# EAGLE schematic controller_board (EAGLE 9.6.2)
Assembly variants: Minimal, FullAwesome
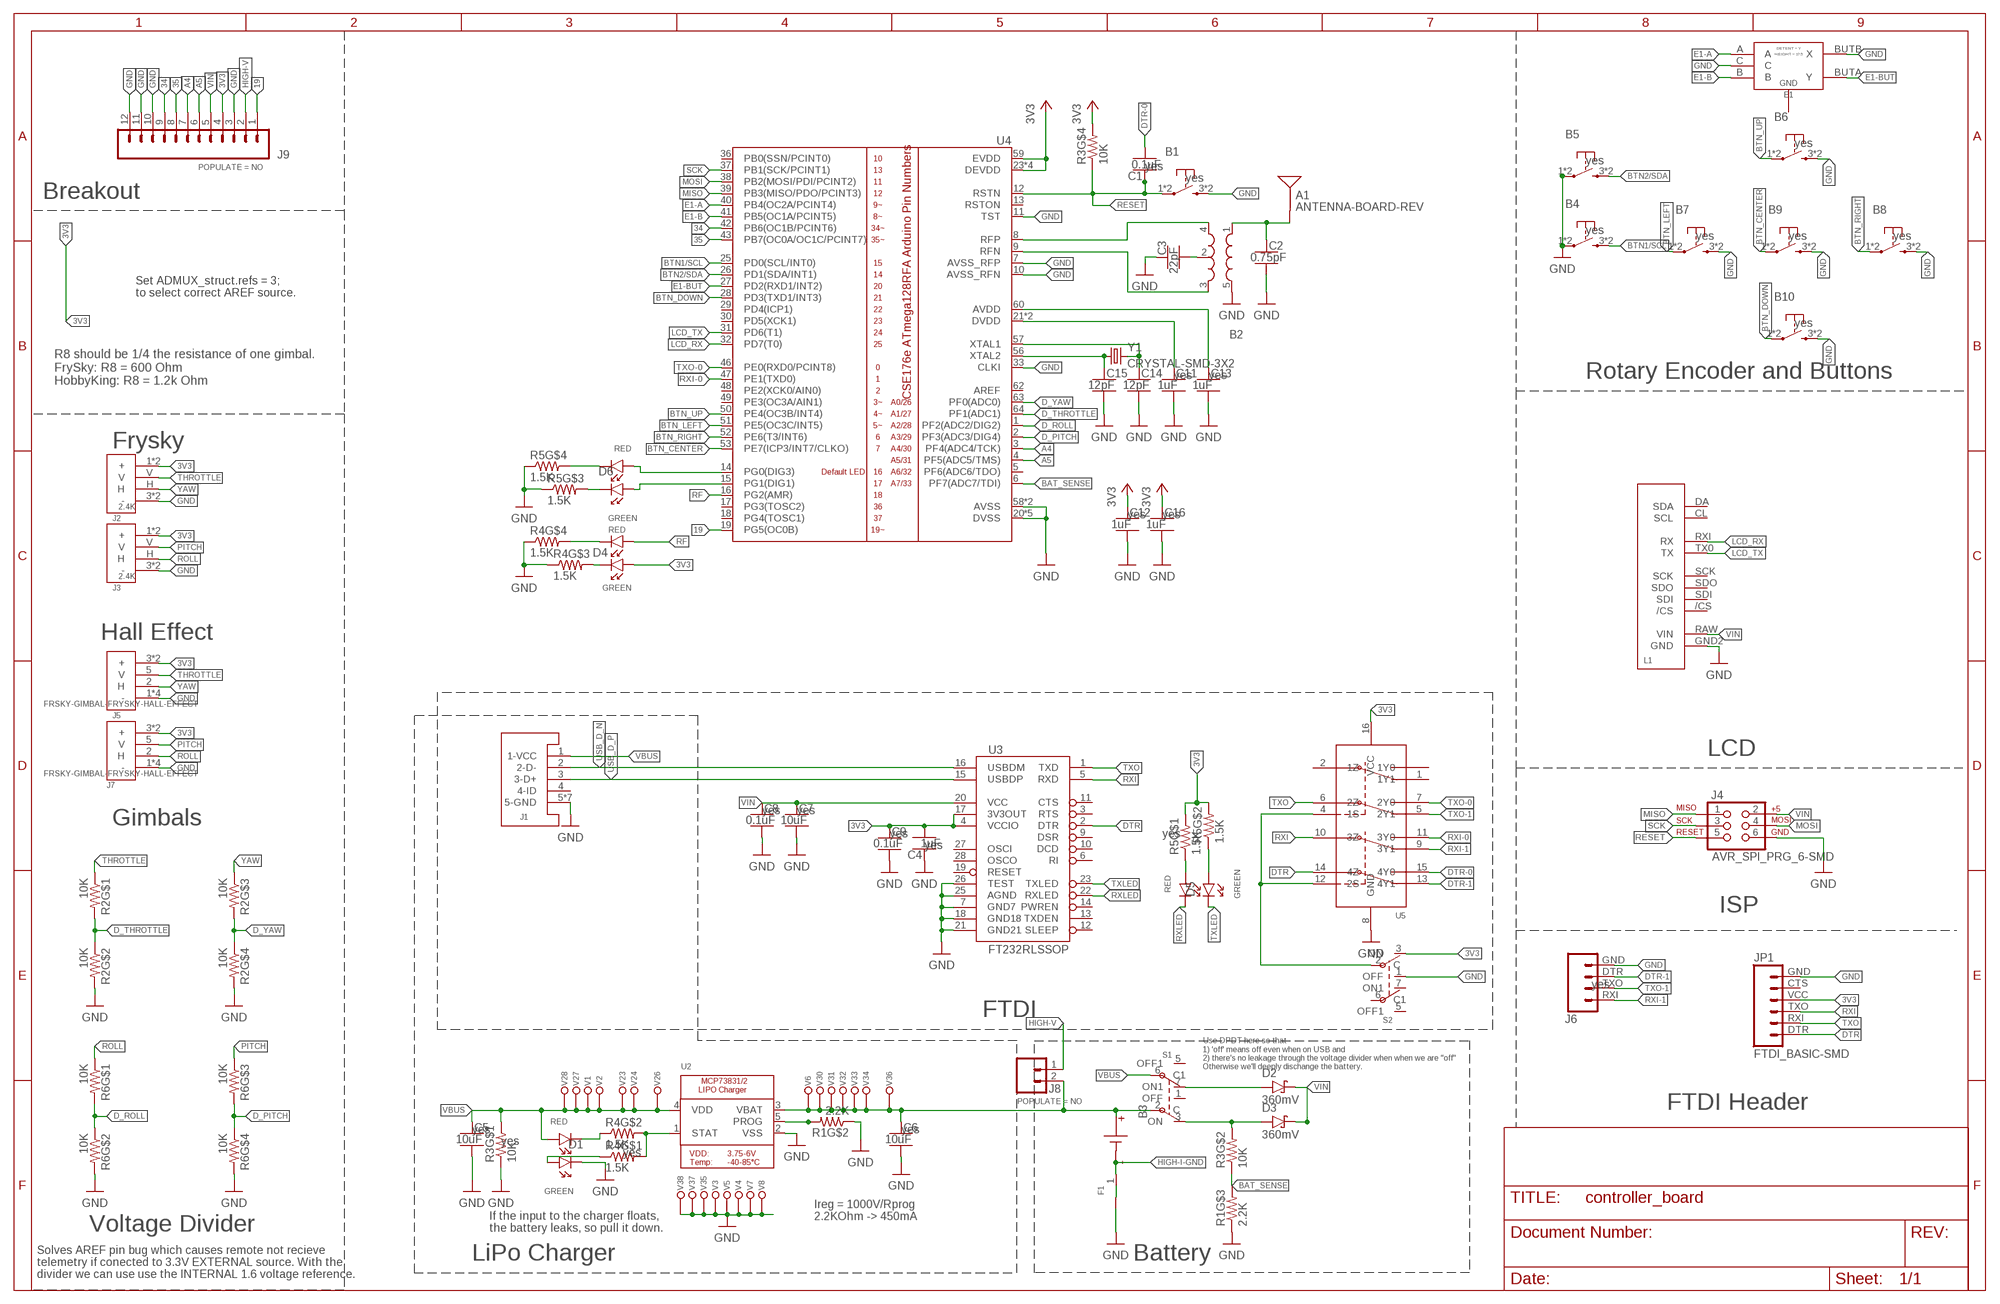
[diagram p0: schematic, sheet 1]
FRAME1 (FRAME_B_L): CREATOR: Unknown; DIST: Unknown; DISTPN: Unknown

## Parts
A1  ANTENNA-BOARD-REV  [ANT_PCB_2.4GHZ_NRF8001_1.6MM_1OZ_REV]
B1  PUSHBUTTON_-4.5X4.5  [4.5MM_TACTILE_SWITCH_TL3305AF160QG]
B2  BALUN0805  [BALUN]
B3  BATTERY-SCREW-TERMINAL  [SCREW-TERMINAL-1X2-2.54MM]
B4  PUSHBUTTON_-4.5X4.5  [4.5MM_TACTILE_SWITCH_TL3305AF160QG]  (not fitted in variant Minimal)
B5  PUSHBUTTON_-4.5X4.5  [4.5MM_TACTILE_SWITCH_TL3305AF160QG]  (not fitted in variant Minimal)
B6  PUSHBUTTON_-4.5X4.5  [4.5MM_TACTILE_SWITCH_TL3305AF160QG]
B7  PUSHBUTTON_-4.5X4.5  [4.5MM_TACTILE_SWITCH_TL3305AF160QG]
B8  PUSHBUTTON_-4.5X4.5  [4.5MM_TACTILE_SWITCH_TL3305AF160QG]
B9  PUSHBUTTON_-4.5X4.5  [4.5MM_TACTILE_SWITCH_TL3305AF160QG]
B10  PUSHBUTTON_-4.5X4.5  [4.5MM_TACTILE_SWITCH_TL3305AF160QG]
C1  0.1uF  CAPACITOR-NP_SMD-0603_CERAMIC-0.1UF  [CAPC1608X100]
C2  0.75pF  CAPACITOR-NP_SMD-0603_CERAMIC-0.75PF  [CAPC1608X100]
C3  22pF  CAPACITOR-NP_SMD-0603_CERAMIC-22PF  [CAPC1608X100]
C4  1uF  CAPACITOR-NP_SMD-0603_CERAMIC-1UF  [CAPC1608X100]
C5  10uF  CAPACITOR-NP_SMD-0603_CERAMIC-10UF  [CAPC1608X100]
C6  10uF  CAPACITOR-NP_SMD-0603_CERAMIC-10UF  [CAPC1608X100]
C7  10uF  CAPACITOR-NP_SMD-0603_CERAMIC-10UF  [CAPC1608X100]  (not fitted in variant Minimal)
C8  0.1uF  CAPACITOR-NP_SMD-0603_CERAMIC-0.1UF  [CAPC1608X100]  (not fitted in variant Minimal)
C9  0.1uF  CAPACITOR-NP_SMD-0603_CERAMIC-0.1UF  [CAPC1608X100]  (not fitted in variant Minimal)
C11  1uF  CAPACITOR-NP_SMD-0603_CERAMIC-1UF  [CAPC1608X100]
C12  1uF  CAPACITOR-NP_SMD-0603_CERAMIC-1UF  [CAPC1608X100]
C13  1uF  CAPACITOR-NP_SMD-0603_CERAMIC-1UF  [CAPC1608X100]
C14  12pF  CAPACITOR-NP_SMD-0603_CERAMIC-12PF  [CAPC1608X100]
C15  12pF  CAPACITOR-NP_SMD-0603_CERAMIC-12PF  [CAPC1608X100]
C16  1uF  CAPACITOR-NP_SMD-0603_CERAMIC-1UF  [CAPC1608X100]
D1  LED-2X-GREEN/RED-1.6X1.5MM  [LED-2X-LITE-ON-1.6MMX1.5MM]
D2  360mV  DIODE-SCHOTTKY_-SMD-SOD123  [SODFL3516X96]
D3  360mV  DIODE-SCHOTTKY_-SMD-SOD123  [SODFL3516X96]
D4  LED-2X-GREEN/RED-1.6X1.5MM  [LED-2X-LITE-ON-1.6MMX1.5MM]
D5  LED-2X-GREEN/RED-1.6X1.5MM  [LED-2X-LITE-ON-1.6MMX1.5MM]  (not fitted in variant Minimal)
D6  LED-2X-GREEN/RED-1.6X1.5MM  [LED-2X-LITE-ON-1.6MMX1.5MM]
E1  ROTARY-ENCODER-W/BUTTON-BOURNS-PEC12R-4217F  [BOURNS-PEC12R]
F1  SHORT  [SHORT]
J1  USB-MICROA-AMPHENOL-10118192-0001LF  [USB-MICROA-10118192-0001LF]  (not fitted in variant Minimal)
J2  2.4K  FRSKY-GIMBAL-FRYSKY  [JST-13-PTH]  (not fitted in variant Minimal)
J3  2.4K  FRSKY-GIMBAL-FRYSKY  [JST-13-PTH]  (not fitted in variant Minimal)
J4  AVR_SPI_PRG_6-SMD  [2X3-SMD]
J5  FRSKY-GIMBAL-FRYSKY-HALL-EFFECT  [MOLEX-0532610671]
J6  FTDI-4PIN-RIGHT-ANGLE-SMD  [HEADER-2X2-0.1IN-MALE-RIGHT-ANGLE-SMD]
J7  FRSKY-GIMBAL-FRYSKY-HALL-EFFECT  [MOLEX-0532610671]
J8  HEADER-0.1IN-2POS-SCREW  [SCREW-TERMINAL-1X2-2.54MM]
J9  HEADER-12POS-0.1IN-FEMALE-TH  [HDRVR12W75P254_1X12_3098X254X850B]
JP1  FTDI_BASIC-SMD  [FTDI-BASIC-SMD]
L1  SPARKFUN_SERLCD_SERIAL_REDUCED-SMD  [SPARKFUN_SERLCD_16X2_REDUCED_SMD]
R1  2.2K  RESISTOR-PACK-4X-2.2K  [RESCAXS50P200X100X45-8]
R2  10K  RESISTOR-PACK-4X-10K  [RESCAXS50P200X100X45-8]
R3  10K  RESISTOR-PACK-4X-10K  [RESCAXS50P200X100X45-8]
R4  1.5K  RESISTOR-PACK-4X-1.5K  [RESCAXS50P200X100X45-8]
R5  1.5K  RESISTOR-PACK-4X-1.5K  [RESCAXS50P200X100X45-8]
R6  10K  RESISTOR-PACK-4X-10K  [RESCAXS50P200X100X45-8]
S1  SWITCH-DPDT-300MA-6V-SMD  [JS202011JCQN]
S2  SWITCH-DPDT-300MA-6V-SMD  [JS202011JCQN]
U2  MCP73831T-2ACI/OT  MCP73831/2  [SOT23-5]
U3  FT232RLSSOP  [SSOP28DB]  (not fitted in variant Minimal)
U4  ATMEGA128RFA1  [QFN-64]
U5  DPDT-X2  [SOP65P640X110-16]  (not fitted in variant Minimal)
V1  LOCKED-VIA-0.2  [VIA-0.2MM]
V2  LOCKED-VIA-0.2  [VIA-0.2MM]
V3  LOCKED-VIA-0.2  [VIA-0.2MM]
V4  LOCKED-VIA-0.2  [VIA-0.2MM]
V5  LOCKED-VIA-0.2  [VIA-0.2MM]
V6  LOCKED-VIA-0.2  [VIA-0.2MM]
V7  LOCKED-VIA-0.2  [VIA-0.2MM]
V8  LOCKED-VIA-0.2  [VIA-0.2MM]
V23  LOCKED-VIA-0.2  [VIA-0.2MM]
V24  LOCKED-VIA-0.2  [VIA-0.2MM]
V26  LOCKED-VIA-0.2  [VIA-0.2MM]
V27  LOCKED-VIA-0.2  [VIA-0.2MM]
V28  LOCKED-VIA-0.2  [VIA-0.2MM]
V30  LOCKED-VIA-0.2  [VIA-0.2MM]
V31  LOCKED-VIA-0.2  [VIA-0.2MM]
V32  LOCKED-VIA-0.2  [VIA-0.2MM]
V33  LOCKED-VIA-0.2  [VIA-0.2MM]
V34  LOCKED-VIA-0.2  [VIA-0.2MM]
V35  LOCKED-VIA-0.2  [VIA-0.2MM]
V36  LOCKED-VIA-0.2  [VIA-0.2MM]
V37  LOCKED-VIA-0.2  [VIA-0.2MM]
V38  LOCKED-VIA-0.2  [VIA-0.2MM]
Y1  CRYSTAL-SMD-3X2  [OSCCC320X250X85]

## Nets
3V3: C4.2 C9.1 C12.1 C16.1 D4.A1 J2.1(+) J2.4(+) J3.1(+) J3.4(+) J5.3(+) J5.6(+) J7.3(+) J7.6(+) J9.4 JP1.VCC R3.8 R5.5 R5.6 S2.3(ON) U3.4(VCCIO) U3.17(3V3OUT) U4.23(DEVDD) U4.34(DEVDD) U4.44(DEVDD) U4.54(DEVDD) U4.59(EVDD) U5.16(VCC)
19: J9.1 U4.19(PG5(OC0B))
34: J9.9 U4.42(PB6(OC1B/PCINT6))
35: J9.8 U4.43(PB7(OC0A/OC1C/PCINT7))
A4: J9.7 U4.3(PF4(ADC4/TCK))
A5: J9.6 U4.4(PF5(ADC5/TMS))
ANTENNA [RFSIG]: A1.FEED(SIGNAL) B2.1(IN) C2.1
BAT_SENSE: R1.7 R3.3 U4.6(PF7(ADC7/TDI))
BCAP: B2.2(GND) C3.2
BPOS [HIGH-I]: B3.2(P) C6.1 J8.2 S1.2(C) U2.3(VBAT) V6.P1(N) V30.P1(N) V31.P1(N) V32.P1(N) V33.P1(N) V34.P1(N) V36.P1(N)
BTN1/SCL: B4.3 B4.4 U4.25(PD0(SCL/INT0))
BTN2/SDA: B5.3 B5.4 U4.26(PD1(SDA/INT1))
BTN_CENTER: B9.1 B9.2 U4.53(PE7(ICP3/INT7/CLKO))
BTN_DOWN: B10.1 B10.2 U4.28(PD3(TXD1/INT3))
BTN_LEFT: B7.1 B7.2 U4.51(PE5(OC3C/INT5))
BTN_RIGHT: B8.1 B8.2 U4.52(PE6(T3/INT6))
BTN_UP: B6.1 B6.2 U4.50(PE4(OC3B/INT4))
CLK_NEG: C15.1 U4.56(XTAL2) Y1.1
CLK_POS: C14.1 U4.57(XTAL1) Y1.3
D_PITCH: R6.1 R6.7 U4.2(PF3(ADC3/DIG4))
D_ROLL: R6.3 R6.5 U4.1(PF2(ADC2/DIG2))
D_THROTTLE: R2.3 R2.5 U4.64(PF1(ADC1))
D_YAW: R2.1 R2.7 U4.63(PF0(ADC0))
DTR: JP1.DTR U3.2(DTR) U5.14(4Z)
DTR-0: C1.2 U5.15(4Y0)
DTR-1: J6.DTR U5.13(4Y1)
E1-A: E1.A U4.40(PB4(OC2A/PCINT4))
E1-B: E1.B U4.41(PB5(OC1A/PCINT5))
E1-BUT: E1.BUTA(Y) U4.27(PD2(RXD1/INT2))
GND: B1.3 B1.4 B2.5(GND) B4.1 B4.2 B5.1 B5.2 B6.3 B6.4 B7.3 B7.4 B8.3 B8.4 B9.3 B9.4 B10.3 B10.4 C2.2 C3.1 C4.1 C5.2 C6.2 C7.2 C8.2 C9.2 C11.2 C12.2 C13.2 C14.2 C15.2 C16.2 D1.C1 E1.BUTB(X) E1.C F1.2(B) J1.5(5-GND) J1.6(5-GND) J1.7(5-GND) J1.8(5-GND) J1.9(5-GND) J1.10(5-GND) J1.11(5-GND) J2.3(-) J2.6(-) J3.3(-) J3.6(-) J4.6 J5.1(-) J5.4(-) J5.G1(-) J5.G2(-) J6.GND J7.1(-) J7.4(-) J7.G1(-) J7.G2(-) J9.3 J9.10 J9.11 J9.12 JP1.GND L1.GND2(GND) R1.2 R1.3 R2.6 R2.8 R3.4 R4.1 R4.2 R5.1 R5.2 R6.6 R6.8 S2.1(OFF) U2.2(VSS) U3.7(GND7) U3.18(GND18) U3.21(GND21) U3.25(AGND) U3.26(TEST) U4.7(AVSS_RFP) U4.10(AVSS_RFN) U4.11(TST) U4.20(DVSS) U4.24(DVSS) U4.33(CLKI) U4.35(DVSS) U4.45(DVSS) U4.55(DVSS) U4.58(AVSS) U4.61(AVSS) U5.8(GND) V3.P1(N) V4.P1(N) V5.P1(N) V7.P1(N) V8.P1(N) V35.P1(N) V37.P1(N) V38.P1(N)
HIGH-I-GND [HIGH-I]: B3.1(N) F1.1(A)
HIGH-V [HIGH-I]: J8.1 J9.2
LCD_RX: L1.RXI(RX) U4.32(PD7(T0))
LCD_TX: L1.TX0(TX) U4.31(PD6(T1))
MISO: J4.1 U4.39(PB3(MISO/PDO/PCINT3))
MOSI: J4.4 U4.38(PB2(MOSI/PDI/PCINT2))
N$1: D1.A1 R4.4
N$2: D1.C2 R4.3
N$3: D5.A1 R5.3
N$4: D6.C2 R5.8
N$5: D6.C1 R5.7
N$6: D4.C1 R4.7
N$7: D5.A2 R5.4
N$8: D6.A2 U4.14(PG0(DIG3))
N$9: D6.A1 U4.15(PG1(DIG1))
N$11: R4.5 R4.6 U2.1(STAT)
N$12: R1.6 U2.5(PROG)
N$13: D4.C2 R4.8
N$14 [HIGH-I]: D2.2(A) S1.7(ON1)
N$20: C11.1 U4.21(DVDD) U4.22(DVDD)
N$21: C13.1 U4.60(AVDD)
PITCH: J3.V J7.5(V) R6.2
PROG_SEL: S2.2(C) U5.4(1S) U5.12(2S)
RESET: B1.1 B1.2 C1.1 J4.5 R3.1 U4.12(RSTN)
RF: D4.A2 U4.16(PG2(AMR))
RF_N: B2.3(OUT2) U4.9(RFN)
RF_P: B2.4(OUT1) U4.8(RFP)
ROLL: J3.H J7.2(H) R6.4
RXI: JP1.TXO U3.5(RXD) U5.10(3Z)
RXI-0: U4.47(PE1(TXD0)) U5.11(3Y0)
RXI-1: J6.RXI U5.9(3Y1)
RXLED: D5.C2 U3.22(RXLED)
SCK: J4.3 U4.37(PB1(SCK/PCINT1))
THROTTLE: J2.V J5.5(V) R2.4
TXLED: D5.C1 U3.23(TXLED)
TXO: JP1.RXI U3.1(TXD) U5.6(2Z)
TXO-0: U4.46(PE0(RXD0/PCINT8)) U5.7(2Y0)
TXO-1: J6.TXO U5.5(2Y1)
USB_D_N: J1.2(2-D-) U3.16(USBDM)
USB_D_P: J1.3(3-D+) U3.15(USBDP)
VBAT [HIGH-I]: D3.2(A) R3.6 S1.3(ON)
VBUS [HIGH-I]: C5.1 D1.A2 J1.1(1-VCC) R3.5 S1.6(C1) U2.4(VDD) V1.P1(N) V2.P1(N) V23.P1(N) V24.P1(N) V26.P1(N) V27.P1(N) V28.P1(N)
VIN [HIGH-I]: C7.1 C8.1 D2.1(C) D3.1(C) J4.2 J9.5 L1.RAW(VIN) U3.20(VCC)
YAW: J2.H J5.2(H) R2.2
Unconnected: E1.G1(GND) E1.G2(GND) J1.4(4-ID) JP1.CTS L1./CS L1.CL(SCL) L1.DA(SDA) L1.SCK L1.SDI L1.SDO R1.1 R1.4 R1.5 R1.8 R3.2 R3.7 S1.1(OFF) S1.5(OFF1) S2.5(OFF1) S2.6(C1) S2.7(ON1) U3.3(RTS) U3.6(RI) U3.9(DSR) U3.10(DCD) U3.11(CTS) U3.12(SLEEP) U3.13(TXDEN) U3.14(PWREN) U3.19(RESET) U3.27(OSCI) U3.28(OSCO) U4.5(PF6(ADC6/TDO)) U4.13(RSTON) U4.17(PG3(TOSC2)) U4.18(PG4(TOSC1)) U4.29(PD4(ICP1)) U4.30(PD5(XCK1)) U4.36(PB0(SSN/PCINT0)) U4.48(PE2(XCK0/AIN0)) U4.49(PE3(OC3A/AIN1)) U4.62(AREF) U5.1(1Y1) U5.2(1Z) U5.3(1Y0)

## Notes on the sheet
- Breakout
- Set ADMUX_struct.refs = 3;
  to select correct AREF source.
- Rotary Encoder and Buttons
- R8 should be 1/4 the resistance of one gimbal.
  FrySky: R8 = 600 Ohm
  HobbyKing: R8 = 1.2k Ohm
- Frysky
- Hall Effect
- LCD
- Gimbals
- ISP
- FTDI
- Use DPDT here so that 
  1) 'off' means off even when on USB and 
  2) there's no leakage through the voltage divider when when we are "off"  
  Otherwise we'll deeply dischange the battery.
- FTDI Header
- Ireg = 1000V/Rprog
  2.2KOhm -> 450mA
- Voltage Divider
- If the input to the charger floats, 
  the battery leaks, so pull it down.
- LiPo Charger | Battery
- Solves AREF pin bug which causes remote not recieve 
  telemetry if conected to 3.3V EXTERNAL source. With the 
  divider we can use use the INTERNAL 1.6 voltage reference.

## Library data of the parts
A1 = quadparts_prebuilt:ANTENNA: Single endded antenna.; CREATOR: Swanson; DESC: trace antenna; DIST: NA; DISTPN: NA; MFR: NA; MOUNTING: NONE; MPN: NA; POPULATE: NO
B1 B4-B10 = quadparts_prebuilt:PUSHBUTTON_: "Tactile" or "clicky" button.; CREATOR: Swanson; DESC: SWITCH TACTILE SPST-NO 50MA 12V; DIST: DIGIKEY; DISTPN: EG5350CT-ND; MFR: E-Switch; MOUNTING: SMD; MPN: TL3305AF160QG; SUBSTITUTE_OK: yes
B2 = quadparts_prebuilt:BALUN: A balun to convert differential radio-frequency outputs from the microcontroller into a single-ended driver for the antenna.; CREATOR: Swanson; DATASHEET: http://katalog.we-online.de/pbs/datasheet/748421245.pdf; DESC: BALUN 2.4GHZ-2.5GHZ 50/100 0805; DIST: Digikey; DISTPN: 732-2230-1-ND; MFR: Wurth Electronics Inc.; MOUNTING: SMD; MPN: 748421245; PACKAGE: 0805; PRICE: 2.63; REVIEWER: Swanson
B3 = quadparts_prebuilt_2022:BATTERY: Connections for a battery.; CREATOR: Swanson; DIST: DIGIKEY; DISTPN: ED10561-ND; MOUNTING: TH; PIN1: -; PIN2: +
C1 C8 C9 = quadparts_prebuilt:CAPACITOR-NP_: Nonpolarized capacitor; CREATOR: Swanson; DESC: CAP CER 0.1UF 10V X7R 0603; DIST: Digikey; DISTPN: 399-1095-1-ND; MFR: KEMET; MOUNTING: SMD; MPN: C0603C104K8RACTU; PACKAGE: 0603; SUBSTITUTE_OK: yes
C2 = quadparts_prebuilt:CAPACITOR-NP_: Nonpolarized capacitor; CREATOR: Swanson; DESC: CAP CER 0.75PF 50V NPO 0603; DIST: Digikey; DISTPN: 311-3843-1-ND; MFR: Yageo; MOUNTING: SMD; MPN: CC0603BRNPO9BNR75; PACKAGE: 0603
C3 = quadparts_prebuilt:CAPACITOR-NP_: Nonpolarized capacitor; CREATOR: Swanson; DESC: CAP CER 22PF 6.3V NP0 0603; DIST: Digikey; DISTPN: 478-11384-1-ND; MFR: AVX Corporation; MOUNTING: SMD; MPN: 06036A220KAT2A; PACKAGE: 0603
C4 C11-C13 C16 = quadparts_prebuilt:CAPACITOR-NP_: Nonpolarized capacitor; CREATOR: Swanson; DESC: CAP CER 1UF 10V X5R 0603; DIST: Digikey; DISTPN: 1276-1182-1-ND; MFR: Samsung Electro-Mechanics; MOUNTING: SMD; MPN: CL10A105KP8NNNC; PACKAGE: 0603; SUBSTITUTE_OK: yes
C5-C7 = quadparts_prebuilt:CAPACITOR-NP_: Nonpolarized capacitor; CREATOR: Swanson; DESC: CAP CER 10UF 6.3V X5R 0603; DIST: Digikey; DISTPN: 1276-1119-1-ND; MFR: Samsung Electro-Mechanics; MOUNTING: SMD; MPN: CL10A106MQ8NNNC; PACKAGE: 0603; SUBSTITUTE_OK: yes
C14 C15 = quadparts_prebuilt:CAPACITOR-NP_: Nonpolarized capacitor; CREATOR: Swanson; DESC: CAP CER 12PF 10V C0G/NP0 0603; DIST: Digikey; DISTPN: 720-1655-1-ND; MFR: Vishay Vitramon; MOUNTING: SMD; MPN: VJ0603A120FXQCW1BC; PACKAGE: 0603
D1 D4-D6 = RemoteParts:LED-2X; COLOR1: RED; COLOR2: GREEN; CREATOR: Swanson; DESC: LED GREEN/RED CLEAR CHIP SMD; DIST: DIGIKEY; DISTPN: 160-2252-1-ND; MFR: Lite-On Inc.; MOUNTING: SMD; MPN: LTST-C195TGKRKT; PACKAGE: 4SMD
D2 D3 = quadparts_prebuilt:DIODE-SCHOTTKY_: Schottky diode; CREATOR: Swanson; DESC: DIODE SCHOTTKY 30V 1.5A SFLAT; DIST: Digikey; DISTPN: CRS08QMCT-ND; MFR: Toshiba Semiconductor and Storage; MOUNTING: SMD; MPN: CRS08(TE85L,Q,M); REVIEWER: Swanson
E1 = RemoteParts:ROTARY-ENCODER-W/BUTTON; AUX1DIST: DIGIKEY; AUX1DISTPN: 1722-1241-ND; AUX1MFR: Davies Molding, LLC; AUX1MPN: 1221-J; CREATOR: Swanson; DESC: ROTARY ENCODER MECHANICAL 24PPR; DETENT: Y; DIST: DIGIKEY; DISTPN: PEC12R-4217F-S0024-ND; HEIGHT: 17.5; MFR: Bourns Inc.; MOUNTING: TH; MPN: PEC12R-4217F-S0024; SUBSTITUTE_OK: NO
F1 = RemoteParts:SHORT; CREATOR: Swanson; DESC: NA; DIST: NA; DISTPN: NA; MFR: NA; MOUNTING: NONE; MPN: NA; POPULATE: NO
J1 = RemoteParts:USB; CREATOR: Swanson; DESC: CONN RCPT USB2.0 MICRO B SMD R/A; DIST: DIGIKEY; DISTPN: 609-4613-1-ND; MFR: Amphenol ICC (FCI); MOUNTING: SMD; MPN: 10118192-0001LF
J2 = RemoteParts:FRSKY-GIMBAL; CREATOR: Swanson; DESC: CONN HEADER VERT 12POS 2MM; DIST: Digikey; DISTPN: A100106-ND; MFR: TE Connectivity AMP Connectors; MOUNTING: TH; MPN: 1-1735446-2; POPULATE: NO
J3 = RemoteParts:FRSKY-GIMBAL; CREATOR: Swanson; DESC: CONN HEADER VERT 12POS 2MM; DIST: Digikey; DISTPN: A100106-ND; MFR: TE Connectivity AMP Connectors; MOUNTING: TH; MPN: 1-1735446-2; POPULATE: NO; SPICEPREFIX: E
J4 = quadparts_prebuilt:AVR_SPI_PRG_6: AVR ISP 6 Pin This is the in-system programming (ISP) connector for Atmel Microcontrollers programming.; CREATOR: Swanson; DESC: CONN HEADER SMD 6POS 2.54MM; DIST: Digikey; DISTPN: 609-3487-2-ND; MFR: Amphenol ICC (FCI); MOUNTING: SMD; MPN: 95278-101A06LF
J5 J7 = RemoteParts:FRSKY-GIMBAL; CREATOR: Swanson; DESC: CONN HEADER SMD R/A 6POS 1.25MM; DIST: DIGIKEY; DISTPN: WM7624CT-ND; MFR: Molex; MOUNTING: SMD; MPN: 0532610671
J6 = quadparts_prebuilt:FTDI-4PIN; CREATOR: Swanson; DESC: CONN HEADER SMD R/A 4POS 2.54MM; DIST: DIGIKEY; DISTPN: SAM15344-ND; MFR: Samtec Inc.; MOUNTING: SMD; MPN: TSM-102-01-L-DH; SUBSTITUTE_OK: yes
J8 = RemoteParts:HEADER-0.1IN-2POS: 2 pin single inline pin header, socket, or connector; CREATOR: Swanson; DESC: TERM BLK 2P SIDE ENT 2.54MM PCB; DIST: digikey; DISTPN: ED10561-ND; MFR: On Shore Technology Inc.; MOUNTING: TH; MPN: OSTVN02A150; PIN1: 1; PIN2: 2; POPULATE: NO
J9 = quadparts_prebuilt:HEADER-12POS; CREATOR: Swanson; DESC: CONN HDR 12POS 0.1 TIN PCB; DIST: DIGIKEY; DISTPN: S6100-ND; MFR: Sullins Connector Solutions; MOUNTING: TH; MPN: PPTC121LFBN-RC; POPULATE: NO
JP1 = quadparts_prebuilt:FTDI_BASIC: FTDI (USB-serial converter) header bins with labels.; CREATOR: Swanson; DESC: CONN HEADER SMD R/A 6POS 2.54MM; DIST: DIGIKEY; DISTPN: 952-3235-ND; LEFT_PIN: B; MFR: Harwin Inc.; MOUNTING: SMD; MPN: M20-8890645; RIGHT_PIN: G
L1 = RemoteParts:SPARKFUN_SERLCD_SERIAL_REDUCED; AUX1DIST: Sparkfun; AUX1DISTPN: LCD-14072; AUX1MFR: Sparkfun; AUX1MPN: LCD-14072; CREATOR: Swanson; DESC: 10 Position Header, Top or Bottom Entry Connector Surface Mount; DIST: Digikey; DISTPN: S5641-ND; MFR: Sullins Connector Solutions; MOUNTING: SMD; MPN: NPPC101KFXC-RC
R1 = quadparts_prebuilt:RESISTOR-PACK-4X; CREATOR: Swanson; DESC: RES ARRAY 4 RES 2.2K OHM 0804; DIST: DIGIKEY; DISTPN: Y10222CT-ND; MFR: Panasonic Electronic Components; MOUNTING: SMD; MPN: EXB-N8V222JX; SUBSTITUTE_OK: yes
R2 R6 = quadparts_prebuilt_2022:RESISTOR-PACK-4X; CREATOR: Swanson; DESC: RES ARRAY 4 RES 10K OHM 0804; DIST: DIGIKEY; DISTPN: Y10103CT-ND; MFR: Panasonic Electronic Components; MOUNTING: SMD; MPN: EXB-N8V103JX; PACKAGE: 0804
R3 = quadparts_prebuilt:RESISTOR-PACK-4X; CREATOR: Swanson; DESC: RES ARRAY 4 RES 10K OHM 0804; DIST: DIGIKEY; DISTPN: Y10103CT-ND; MFR: Panasonic Electronic Components; MOUNTING: SMD; MPN: EXB-N8V103JX; PACKAGE: 0804; SUBSTITUTE_OK: yes
R4 R5 = quadparts_prebuilt:RESISTOR-PACK-4X; CREATOR: Swanson; DESC: RES ARRAY 4 RES 1.5K OHM 0804; DIST: DIGIKEY; DISTPN: Y10152CT-ND; MFR: Panasonic Electronic Components; MOUNTING: SMD; MPN: EXB-N8V152JX; SUBSTITUTE_OK: yes
S1 S2 = RemoteParts:SWITCH-DPDT; CREATOR: Swanson; DESC: SWITCH SLIDE DPDT 300MA 6V; DIST: DIGIKEY; DISTPN: CKN10723CT-ND; MFR: C&K; MOUNTING: SMD; MPN: JS202011JCQN
U2 = RemoteParts:MCP73831/2: MCP73831/2 LIPO Charger VDD: 3.75 - 6V Temp -40 - 85°C Programmable Charge Rate: 15-500mA NOTE: STAT is a tri-state logic output on the MCP73831 and an open-drain output on the MCP73832. SOT23-5 with 4.2V output and tri-state logic on STAT = MCP73831T-2ACI/OT; CREATOR: Adafruit; DESC: IC CONTROLLR LI-ION 4.2V SOT23-5; DIST: DIGIKEY; DISTPN: MCP73831T-2ACI/OTCT-ND; MFR: Microchip Technology; MOUNTING: SMD; MPN: MCP73831T-2ACI/OT; PACKAGE: SOT23-5
U3 = RemoteParts:FT232RL: USB UART FT232RL 4th Generation USB UART (USB <-> Serial) Controller. Spark Fun Electronics SKU : COM-00650; CREATOR: Swanson; DESC: IC USB FS SERIAL UART 28-SSOP; DIST: DIGIKEY; DISTPN: 768-1007-1-ND; MFR: FTDI; MOUNTING: SMD; MPN: FT232RL-REEL
U4 = quadparts_prebuilt:ATMEGA128RFA1: ATmega128RFA1 8-bit AVR Microcontroller with Low Power 2.4GHz Transceiver for ZigBee and IEEE 802.15.4; CREATOR: Swanson; DATASHEET: http://www.atmel.com/Images/Atmel-8266-MCU_Wireless-ATmega128RFA1_Datasheet.pdf; DESC: IC RF TXRX+MCU 802.15.4 64VFQFN; DIST: Digikey; DISTPN: ATMEGA128RFA1-ZU-ND; MFR: Microchip Technology; MOUNTING: SMD; MPN: ATMEGA128RFA1-ZU; PACKAGE: QFN; PRICE: 10.21; REVIEWER: Swanson
U5 = RemoteParts:DPDT-X2; CREATOR: Swanson; DESC: IC ANALOG SWITCH DPDT 16TSSOP; DIST: DIGIKEY; DISTPN: 568-5300-1-ND; MFR: NXP USA Inc.; MOUNTING: SMD; MPN: NX3L2467PW,118
V1-V8 V23 V24 V26-V28 V30-V38 = quadparts_prebuilt:LOCKED-VIA: A via that be removed via ripup.; CREATOR: Swanson; DIST: NA; DISTPN: NA; MFR: NA; MFRPN: NA; MOUNTING: NONE; POPULATE: NO
Y1 = quadparts_prebuilt:CRYSTAL: Crystals to provide clock references for microcontrollers, etc.; CREATOR: Swanson; DESC: CRYSTAL 16.0000MHZ 18PF SMD; DIST: DIGIKEY; DISTPN: 535-9134-1-ND; MFR: Abracon LLC; MOUNTING: SMD; MPN: ABM8-16.000MHZ-B2-T

## Net classes
1 HIGH-I: width 0.508 mm, drill 0.381 mm
2 RFSIG: width 1.016 mm